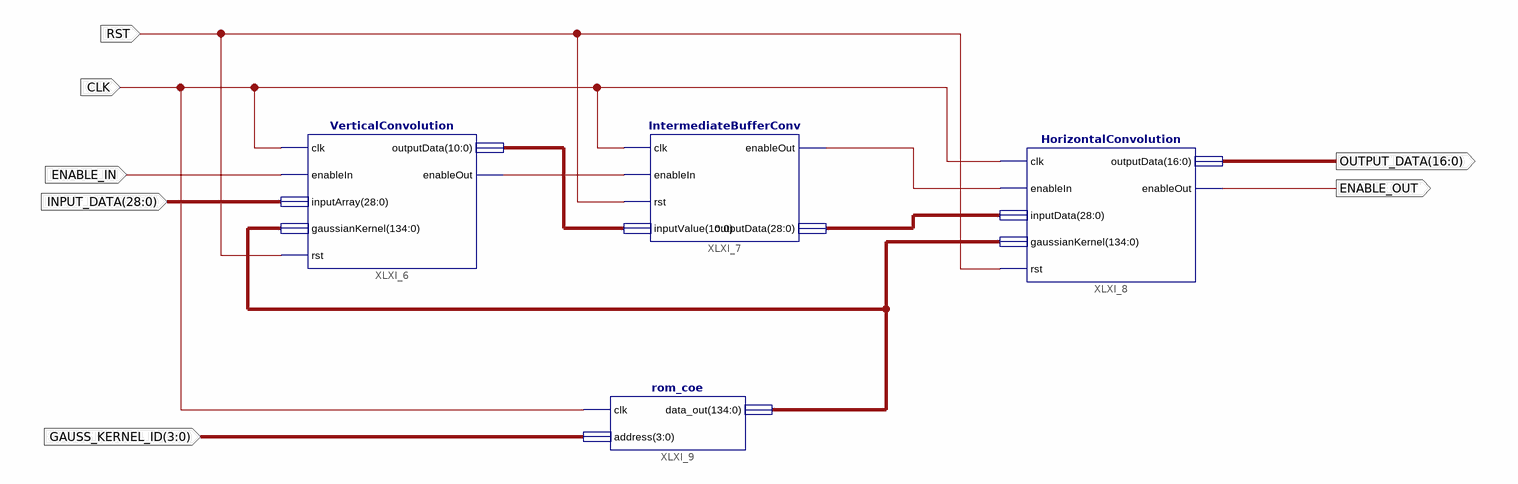
[diagram p0: schematic sheet 1]
// Xilinx ISE schematic GaussianFilter.sch (virtex5) as structural Verilog: 4 symbols, 7 ports
module GaussianFilter (
  input  CLK,
  input  ENABLE_IN,
  input  [28:0] INPUT_DATA,
  input  RST,
  input  [3:0] GAUSS_KERNEL_ID,
  output [16:0] OUTPUT_DATA,
  output ENABLE_OUT
);

  wire XLXN_7, XLXN_9;
  wire [10:0] XLXN_6;
  wire [28:0] XLXN_8;
  wire [134:0] XLXN_15;

  VerticalConvolution XLXI_6 (
    .clk(CLK), .enableIn(ENABLE_IN), .gaussianKernel(XLXN_15), .inputArray(INPUT_DATA), .enableOut(XLXN_7),
    .outputData(XLXN_6), .rst(RST));
  IntermediateBufferConv XLXI_7 (
    .clk(CLK), .enableIn(XLXN_7), .rst(RST), .inputValue(XLXN_6), .enableOut(XLXN_9), .outputData(XLXN_8));
  HorizontalConvolution XLXI_8 (
    .clk(CLK), .enableIn(XLXN_9), .gaussianKernel(XLXN_15), .inputData(XLXN_8), .enableOut(ENABLE_OUT),
    .outputData(OUTPUT_DATA), .rst(RST));
  rom_coe XLXI_9 (.clk(CLK), .address(GAUSS_KERNEL_ID), .data_out(XLXN_15));
endmodule
